# Altium schematic sheet Power_Section.schDoc
size A; SheetNumber: 1; SheetTotal: 8
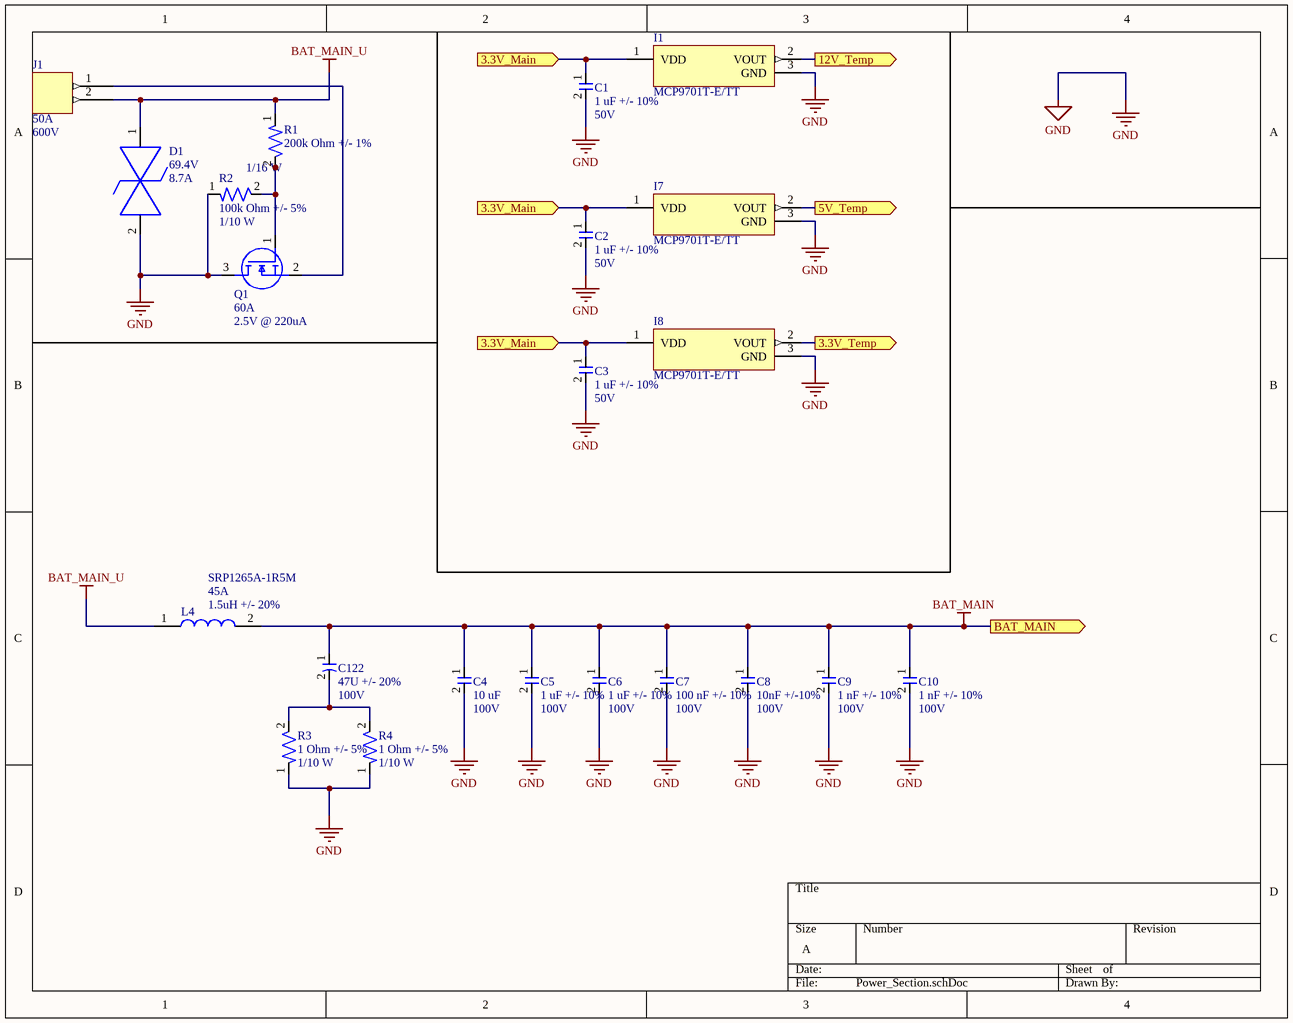
[diagram p0: Power_Section.schDoc]

## Parts
C1  Cap: 1 uF +/- 10%  Voltage: 50V  [CAP-0805]  (hidden comment: GCM21BR71H105KA03L)
C2  Cap: 1 uF +/- 10%  Voltage: 50V  [CAP-0805]  (hidden comment: GCM21BR71H105KA03L)
C3  Cap: 1 uF +/- 10%  Voltage: 50V  [CAP-0805]  (hidden comment: GCM21BR71H105KA03L)
C4  Capcitance: 10 uF  Voltage Rating: 100V  [CAP-1210]  (hidden comment: GRM32EC72A106KE05L)
C5  Capacitance: 1 uF +/- 10%  Voltage: 100V  [CAP-1206 - duplicate]  (hidden comment: C1206X105K101T)
C6  Capacitance: 1 uF +/- 10%  Voltage: 100V  [CAP-1206 - duplicate]  (hidden comment: C1206X105K101T)
C7  Capacitance: 100 nF +/- 10%  Voltage: 100V  [CAP-0603]  (hidden comment: CC0603KRX7R0BB104)
C8  Capacitance: 10nF +/-10%  Voltage Rating: 100V  [CAP-0603]  (hidden comment: CC0603KRX7R0BB103)
C9  Capacitance: 1 nF +/- 10%  Voltage: 100V  [CAP-0402]  (hidden comment: C0402C102K1GECAUTO)
C10  Capacitance: 1 nF +/- 10%  Voltage: 100V  [CAP-0402]  (hidden comment: C0402C102K1GECAUTO)
C122  Capacitance: 47U +/- 20%  Voltage: 100V  [ELEC-47U-0001]  (hidden comment: 100SGV47M12.5X13.5)
D1  Vclamp: 69.4V  Peak pulser current: 8.7A  [DO-214AA (SMBJ)]  (hidden comment: SMBJE43CAH)
I1  MCP9701T-E/TT  [IC-TEMP-0001]
I7  MCP9701T-E/TT  [IC-TEMP-0001]
I8  MCP9701T-E/TT  [IC-TEMP-0001]
J1  Current: 50A  Voltage: 600V  [CON-2POS-0002]  (hidden comment: 0389690002)
L4  SRP1265A-1R5M  Saturation Current: 45A  Inductance: 1.5uH +/- 20%  [PWRIND-1.5U-0002]
Q1  Drain Current: 60A  Vgs: 2.5V @ 220uA  [NMOS-8PowerVDFN]  (hidden comment: TPH7R006PL,L1Q)
R1  Resistance: 200k Ohm +/- 1%  Power: 1/16 W  [RES-0402]  (hidden comment: RC-02W2003FT)
R2  Resistance: 100k Ohm +/- 5%  Power: 1/10 W  [RES-0402]  (hidden comment: ERJ2GEJ104X)
R3  Resistanvce: 1 Ohm +/- 5%  Power: 1/10 W  [RES-0402]  (hidden comment: ERJ2GEJ1R0X)
R4  Resistanvce: 1 Ohm +/- 5%  Power: 1/10 W  [RES-0402]  (hidden comment: ERJ2GEJ1R0X)

## Ports
3.3V_Main (in), 3.3V_Temp (out), 5V_Temp (out), 12V_Temp (out), BAT_MAIN (out)

## Nets
BAT_MAIN: C4.1 C5.1 C6.1 C7.1 C8.1 C9.1 C10.1 C122.1 L4.2 ; port BAT_MAIN
BAT_MAIN_U: D1.1 J1.2 L4.1 R1.1
GND: C1.2 C2.2 C3.2 C4.2 C5.2 C6.2 C7.2 C8.2 C9.2 C10.2 D1.2 I1.3(GND) I7.3(GND) I8.3(GND) Q1.3(D) R2.1 R3.1 R4.1
3.3V_Main: C1.1 C2.1 C3.1 I1.1(VDD) I7.1(VDD) I8.1(VDD) ; port 3.3V_Main
3.3V_Temp: I8.2(VOUT) ; port 3.3V_Temp
5V_Temp: I7.2(VOUT) ; port 5V_Temp
12V_Temp: I1.2(VOUT) ; port 12V_Temp
NetC122_2: C122.2 R3.2 R4.2
NetJ1_1: J1.1 Q1.2(S)
NetQ1_1: Q1.1(G) R1.2 R2.2

## Library data of the parts
C1-C3 = CAP-1U-0003-JLC: 50V 1uF X7R ±10% 0805 Multilayer Ceramic Capacitors MLCC - SMD/SMT ROHS; assembled?: yes; JLC Part Number: C126592
C4 = CAP-10U-0003: 10 µF ±10% 100V Ceramic Capacitor X7S 1210 (3225 Metric); Package Size: 1210
C5 C6 = CAP-1U-0004-JLC: 100V 1uF X7R ±10% 1206 Multilayer Ceramic Capacitors MLCC - SMD/SMT ROHS; assembled: yes; JLC Part Number: C106026
C7 = CAP-100N-0002-JLC: 100V 100nF X7R ±10% 0603 Multilayer Ceramic Capacitors MLCC - SMD/SMT ROHS; assembled?: yes; JLC Part Number: C113803
C8 = CAP-10N-0003-JLC: 100V 10nF X7R ±10% 0603 Multilayer Ceramic Capacitors MLCC - SMD/SMT ROHS; Manufacturer: Yageo; Assembled?: yes; Manufacturer Part Number: CC0603KRX7R0BB103; Temperature Coefficient: X7R; Package Size: 0603; JLC Part Number: C107059
C9 C10 = CAP-1N-0004-JLC: 100V 1nF C0G ±10% 0402 Multilayer Ceramic Capacitors MLCC - SMD/SMT ROHS; assembled?: yes; JLC part number: C696348
C122 = ELEC-47U-0001: 47 µF 100 V Aluminum Electrolytic Capacitors Radial, Can - SMD 2000 Hrs @ 105°C
D1 = DIO-69.4V-0001: 69.4V Clamp 8.7A Ipp Tvs Diode Surface Mount DO-214AA (SMBJ); Channels: Bidirectional; Breakdown VOltage: 47.8V; Reverse working maximum voltage: 43V; Package: DO-214AA (SMBJ)
I1 I7 I8 = IC-TEMP-0001: Temperature Sensor Analog, Local -10°C ~ 125°C 19.5mV/°C SOT-23-3; Manufacturer: Microchip Technology; Assembled?: no; VCC-Max: 5.5V; VCC-Min: 3.3V; Manufacturer Part Number: MCP9701T-E/TT; Package: SOT-23-3
J1 = CON-2POS-0002: 2 Circuit 0.500" (12.70mm) Barrier Block Connector Screws with Captive Plate
L4 = PWRIND-1.5U-0002: 1.5 µH Shielded Drum Core, Wirewound Inductor 27 A 3mOhm Max Nonstandard; Manufacturer: Bourns Electronics; Type: DEV; DC Resistnace: 3.0mOhm max; Copyright: Copyright (C) 2022 Ultra Librarian. All rights reserved.; Manufacturer Part Number: SRP1265A-1R5M; Dimensions: 12.5x13.5x6.2
Q1 = NMOS-60A-0001: N-Channel 60 V 60A (Tc) 81W (Tc) Surface Mount 8-SOP Advance (5x5); Vdss: 60V; Vgs(Max): 20V; Package: 8-PowerVDFN
R1 = RES-200K-0002-JLC: 62.5mW 50V ±1% ±200ppm/℃ -55℃~+155℃ 200kΩ 0402  Chip Resistor - Surface Mount ROHS; assembled?: yes; JLC part number: C258094
R2 = RES-100K-0002-JLC: 100mW Thick Film Resistors ±5% ±200ppm/℃ -55℃~+155℃ 100kΩ 0402  Chip Resistor - Surface Mount ROHS; assembled?: yes; JLC part number: C413017
R3 R4 = RES-1-0002-JLC: 100mW Thick Film Resistors ±5% -100ppm/℃~+600ppm/℃ -55℃~+155℃ 1Ω 0402 Chip Resistor - Surface Mount ROHS; assembled?: yes; JLC part number: C412890